# Altium schematic sheet main.SchDoc
size A4; PageSetup: Record=PageOptions|CenterHorizontal=True|CenterVertical=True|PrintScale=1.00|XCorrection=1.00|YCorrection=1.00|PrintKind=2|BorderSize=5000000|LeftOffset=0|BottomOffset=0|Orientation=2|PaperLength=1000|PaperWidth=1000|Scale=100|PaperSource=7|PrintQuality=-4|MediaType=1|DitherType=10|PaperKind=A4|PrintScaleMode=1
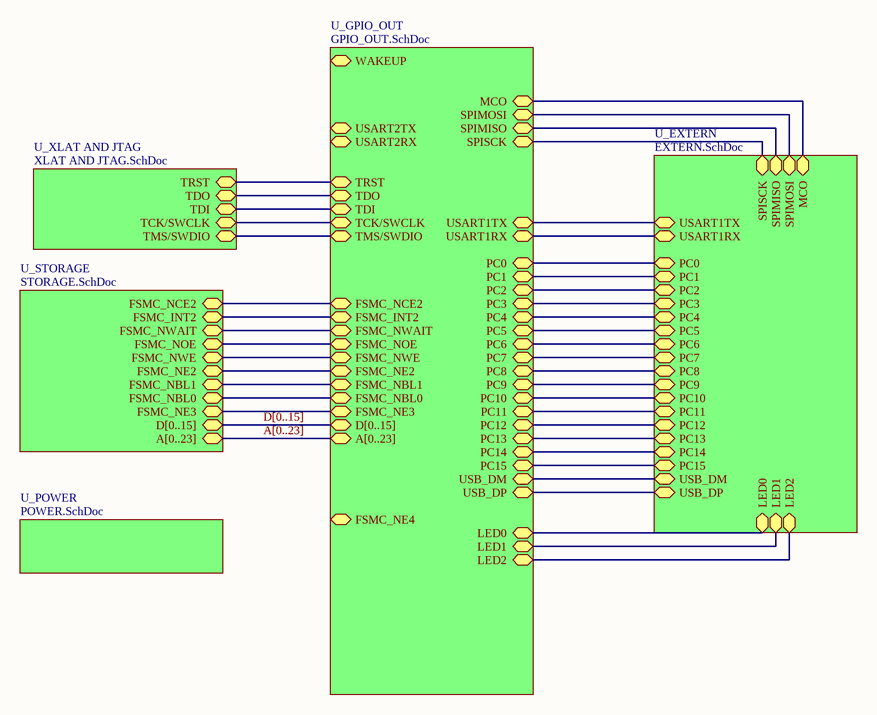
[diagram p0: main.SchDoc]

## Sub-sheets
U_EXTERN = EXTERN.SchDoc: USB_DM (bidir), USB_DP (bidir), LED0 (bidir), LED1 (bidir), LED2 (bidir), USART1TX (bidir), USART1RX (bidir), PC0 (bidir), PC1 (bidir), PC2 (bidir), PC3 (bidir), PC4 (bidir), PC5 (bidir), PC6 (bidir), PC7 (bidir), PC8 (bidir), PC9 (bidir), PC10 (bidir), PC11 (bidir), PC12 (bidir), PC13 (bidir), PC14 (bidir), PC15 (bidir), SPISCK (bidir), SPIMISO (bidir), SPIMOSI (bidir), MCO (bidir)
U_GPIO_OUT = GPIO_OUT.SchDoc: WAKEUP (bidir), USART2TX (bidir), USART2RX (bidir), SPISCK (bidir), SPIMISO (bidir), SPIMOSI (bidir), MCO (bidir), USART1TX (bidir), USART1RX (bidir), TMS/SWDIO (bidir), TCK/SWCLK (bidir), TDI (bidir), TDO (bidir), TRST (bidir), A[0..23] (bidir), D[0..15] (bidir), USB_DM (bidir), USB_DP (bidir), FSMC_NE4 (bidir), FSMC_NE3 (bidir), FSMC_NE2 (bidir), FSMC_INT2 (bidir), FSMC_NBL1 (bidir), FSMC_NBL0 (bidir), FSMC_NCE2 (bidir), FSMC_NWAIT (bidir), FSMC_NWE (bidir), FSMC_NOE (bidir), LED0 (bidir), LED1 (bidir), LED2 (bidir), PC0 (bidir), PC1 (bidir), PC2 (bidir), PC3 (bidir), PC4 (bidir), PC5 (bidir), PC6 (bidir), PC7 (bidir), PC8 (bidir), PC9 (bidir), PC10 (bidir), PC11 (bidir), PC12 (bidir), PC13 (bidir), PC14 (bidir), PC15 (bidir)
U_POWER = POWER.SchDoc: no entries
U_STORAGE = STORAGE.SchDoc: A[0..23] (bidir), D[0..15] (bidir), FSMC_NE3 (bidir), FSMC_NBL0 (bidir), FSMC_NBL1 (bidir), FSMC_NE2 (bidir), FSMC_NWE (bidir), FSMC_NOE (bidir), FSMC_NWAIT (bidir), FSMC_INT2 (bidir), FSMC_NCE2 (bidir)
U_XLAT AND JTAG = XLAT AND JTAG.SchDoc: TMS/SWDIO (bidir), TCK/SWCLK (bidir), TDI (bidir), TDO (bidir), TRST (bidir)

## Nets
(unnamed): sheet U_GPIO_OUT/SPISCK, sheet U_EXTERN/SPISCK
(unnamed): sheet U_GPIO_OUT/SPIMISO, sheet U_EXTERN/SPIMISO
(unnamed): sheet U_GPIO_OUT/SPIMOSI, sheet U_EXTERN/SPIMOSI
(unnamed): sheet U_GPIO_OUT/MCO, sheet U_EXTERN/MCO
(unnamed): sheet U_GPIO_OUT/USART1TX, sheet U_EXTERN/USART1TX
(unnamed): sheet U_GPIO_OUT/USART1RX, sheet U_EXTERN/USART1RX
(unnamed): sheet U_GPIO_OUT/TMS/SWDIO, sheet U_XLAT AND JTAG/TMS/SWDIO
(unnamed): sheet U_GPIO_OUT/TCK/SWCLK, sheet U_XLAT AND JTAG/TCK/SWCLK
(unnamed): sheet U_GPIO_OUT/TDI, sheet U_XLAT AND JTAG/TDI
(unnamed): sheet U_GPIO_OUT/TDO, sheet U_XLAT AND JTAG/TDO
(unnamed): sheet U_GPIO_OUT/TRST, sheet U_XLAT AND JTAG/TRST
(unnamed): sheet U_GPIO_OUT/USB_DM, sheet U_EXTERN/USB_DM
(unnamed): sheet U_GPIO_OUT/USB_DP, sheet U_EXTERN/USB_DP
(unnamed): sheet U_GPIO_OUT/FSMC_NE3, sheet U_STORAGE/FSMC_NE3
(unnamed): sheet U_GPIO_OUT/FSMC_NE2, sheet U_STORAGE/FSMC_NE2
(unnamed): sheet U_GPIO_OUT/FSMC_INT2, sheet U_STORAGE/FSMC_INT2
(unnamed): sheet U_GPIO_OUT/FSMC_NBL1, sheet U_STORAGE/FSMC_NBL1
(unnamed): sheet U_GPIO_OUT/FSMC_NBL0, sheet U_STORAGE/FSMC_NBL0
(unnamed): sheet U_GPIO_OUT/FSMC_NCE2, sheet U_STORAGE/FSMC_NCE2
(unnamed): sheet U_GPIO_OUT/FSMC_NWAIT, sheet U_STORAGE/FSMC_NWAIT
(unnamed): sheet U_GPIO_OUT/FSMC_NWE, sheet U_STORAGE/FSMC_NWE
(unnamed): sheet U_GPIO_OUT/FSMC_NOE, sheet U_STORAGE/FSMC_NOE
(unnamed): sheet U_GPIO_OUT/LED0, sheet U_EXTERN/LED0
(unnamed): sheet U_GPIO_OUT/LED1, sheet U_EXTERN/LED1
(unnamed): sheet U_GPIO_OUT/LED2, sheet U_EXTERN/LED2
(unnamed): sheet U_GPIO_OUT/PC0, sheet U_EXTERN/PC0
(unnamed): sheet U_GPIO_OUT/PC1, sheet U_EXTERN/PC1
(unnamed): sheet U_GPIO_OUT/PC2, sheet U_EXTERN/PC2
(unnamed): sheet U_GPIO_OUT/PC3, sheet U_EXTERN/PC3
(unnamed): sheet U_GPIO_OUT/PC4, sheet U_EXTERN/PC4
(unnamed): sheet U_GPIO_OUT/PC5, sheet U_EXTERN/PC5
(unnamed): sheet U_GPIO_OUT/PC6, sheet U_EXTERN/PC6
(unnamed): sheet U_GPIO_OUT/PC7, sheet U_EXTERN/PC7
(unnamed): sheet U_GPIO_OUT/PC8, sheet U_EXTERN/PC8
(unnamed): sheet U_GPIO_OUT/PC9, sheet U_EXTERN/PC9
(unnamed): sheet U_GPIO_OUT/PC10, sheet U_EXTERN/PC10
(unnamed): sheet U_GPIO_OUT/PC11, sheet U_EXTERN/PC11
(unnamed): sheet U_GPIO_OUT/PC12, sheet U_EXTERN/PC12
(unnamed): sheet U_GPIO_OUT/PC13, sheet U_EXTERN/PC13
(unnamed): sheet U_GPIO_OUT/PC14, sheet U_EXTERN/PC14
(unnamed): sheet U_GPIO_OUT/PC15, sheet U_EXTERN/PC15

## Buses and harness runs
bus A[0..23] = sheet U_GPIO_OUT/A[0..23] = sheet U_STORAGE/A[0..23]
bus D[0..15] = sheet U_GPIO_OUT/D[0..15] = sheet U_STORAGE/D[0..15]